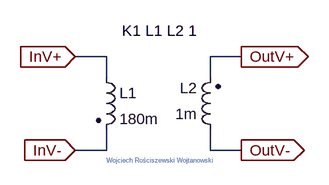
[diagram p0: schematic rectifier circuit with the Graetz bridge.asc]
rectifier circuit with the Graetz bridge.asc, the LTspice schematic file:
Version 4
SHEET 1 880 680
WIRE 128 64 80 64
WIRE 336 64 288 64
WIRE 128 96 128 64
WIRE 288 96 288 64
WIRE 128 208 128 176
WIRE 128 208 80 208
WIRE 288 208 288 176
WIRE 336 208 288 208
FLAG 336 64 OutV+
IOPIN 336 64 Out
FLAG 336 208 OutV-
IOPIN 336 208 Out
FLAG 80 64 InV+
IOPIN 80 64 In
FLAG 80 208 InV-
IOPIN 80 208 In
SYMBOL ind2 112 80 R0
SYMATTR InstName L1
SYMATTR Value 180m
SYMATTR Type ind
SYMATTR SpiceLine Rser=100m
SYMBOL ind2 304 192 R180
WINDOW 0 36 80 Left 2
WINDOW 3 36 40 Left 2
SYMATTR InstName L2
SYMATTR Value 1m
SYMATTR Type ind
SYMATTR SpiceLine Rser=10m
TEXT 128 224 Left 0 ;Wojciech Rościszewski Wojtanowski
TEXT 152 24 Left 2 !K1 L1 L2 1

The netlist it stands for:
* rectifier circuit with the Graetz bridge.asc
L1 InV+ InV- 180m Rser=100m
L2 OutV- OutV+ 1m Rser=10m
* Wojciech Rościszewski Wojtanowski
K1 L1 L2 1
.backanno
.end